# EAGLE design narodmon-sch (EAGLE 8.0.1)
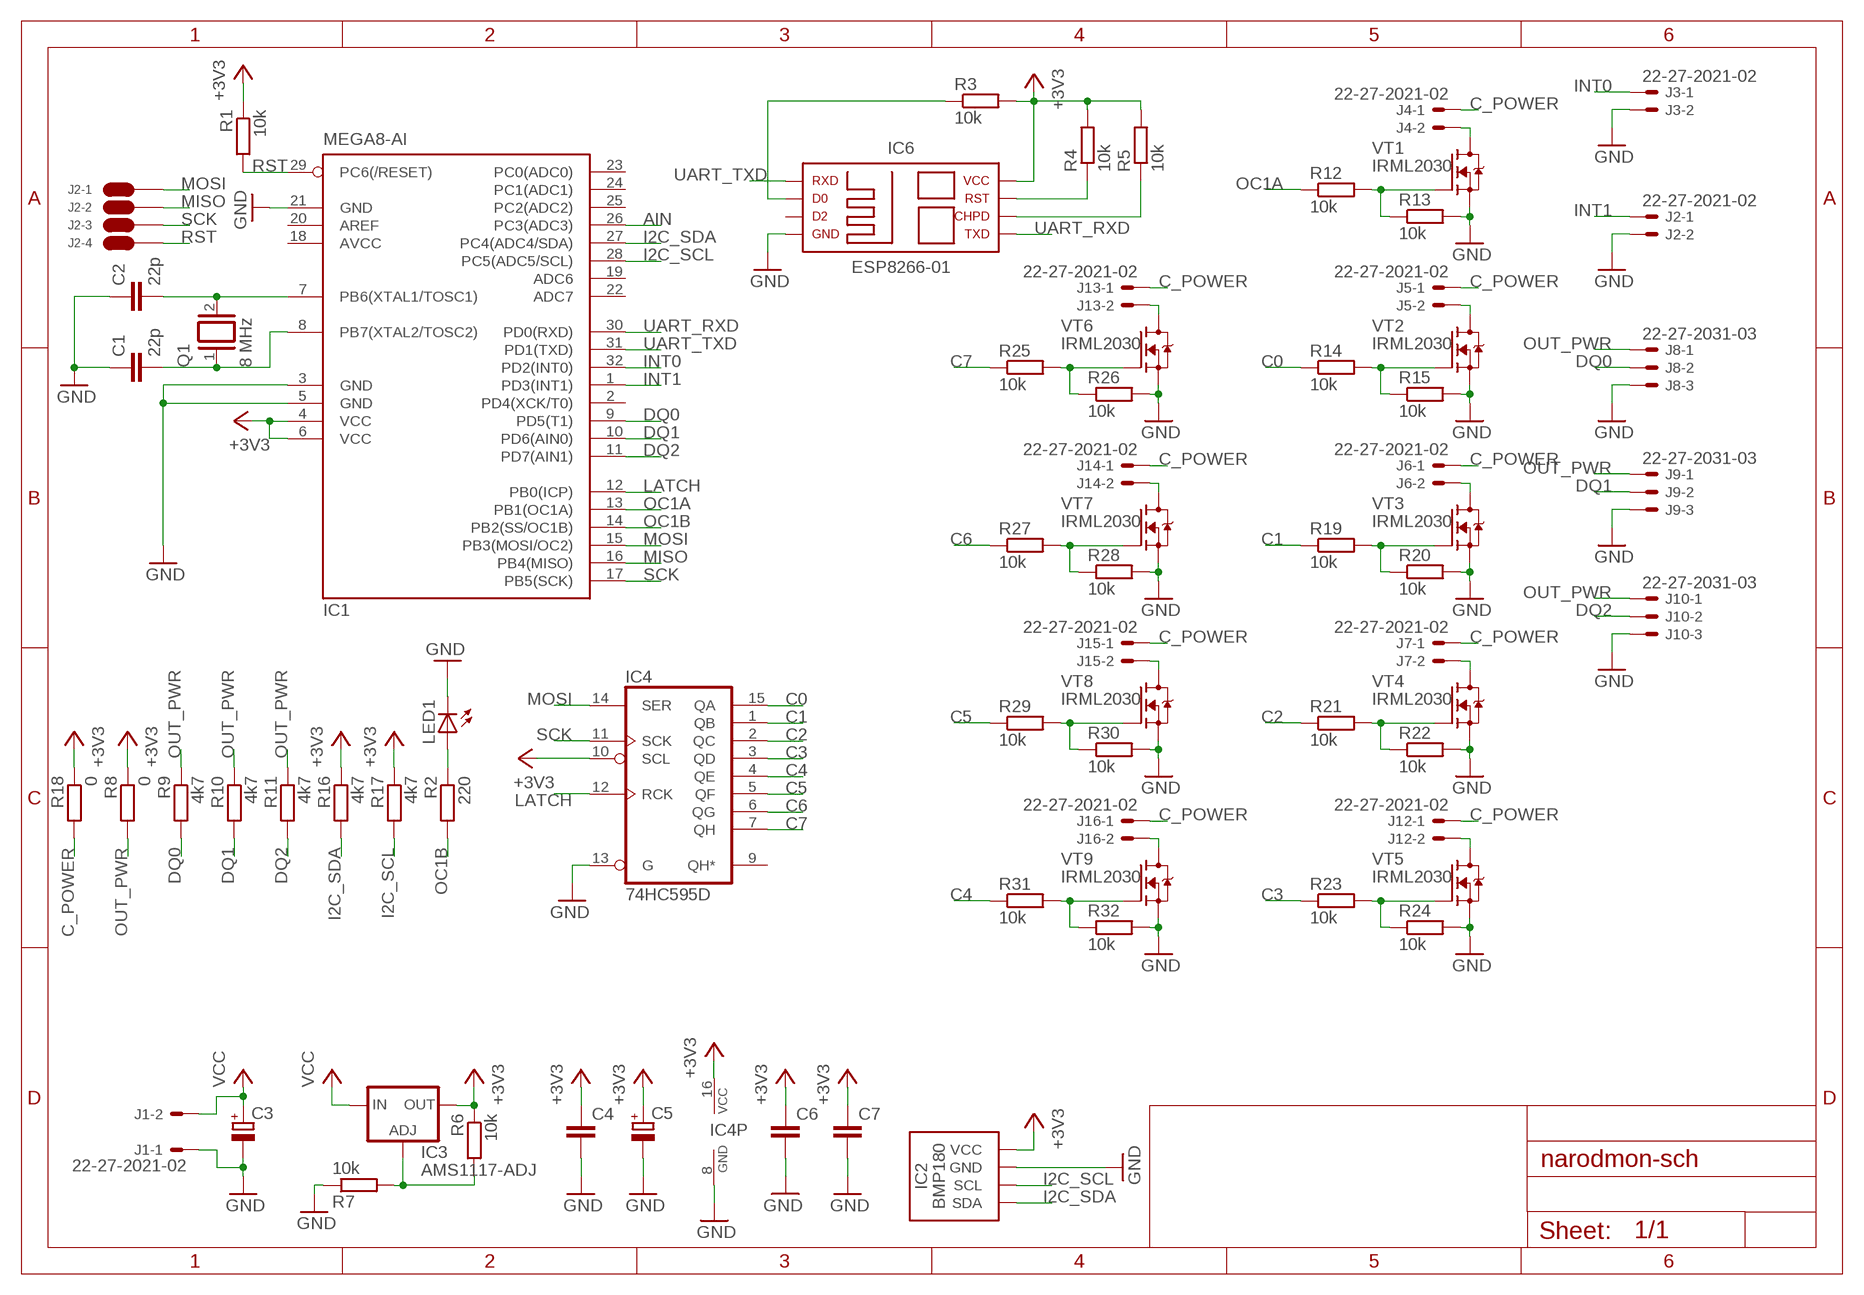
[diagram p0: schematic, sheet 1]

## Parts
C1  22p  C-EUC0603  [C0603]
C2  22p  C-EUC0603  [C0603]
C3  CPOL-EUE3.5-10  [E3,5-10]
C4  C-EUC0805  [C0805]
C5  CPOL-EUE2.5-7  [E2,5-7]
C6  C-EUC0805  [C0805]
C7  C-EUC0805  [C0805]
IC1  MEGA8-AI  [TQFP32-08]
IC2  BMP180C  [BMP180-CHIP]
IC3  AMS1117-ADJ  [SOT223]
IC4  74HC595D  [SO16]
IC6  ESP-01  [ESP-01]
J1  22-27-2021-02  [6410-02]
J2  22-27-2021-02  [6410-02]
J2-1  W1  [W1]
J2-2  W1  [W1]
J2-3  W1  [W1]
J2-4  W1  [W1]
J3  22-27-2021-02  [6410-02]
J4  22-27-2021-02  [6410-02]
J5  22-27-2021-02  [6410-02]
J6  22-27-2021-02  [6410-02]
J7  22-27-2021-02  [6410-02]
J8  22-27-2031-03  [6410-03]
J9  22-27-2031-03  [6410-03]
J10  22-27-2031-03  [6410-03]
J12  22-27-2021-02  [6410-02]
J13  22-27-2021-02  [6410-02]
J14  22-27-2021-02  [6410-02]
J15  22-27-2021-02  [6410-02]
J16  22-27-2021-02  [6410-02]
LED1  LED3MM  [LED3MM]
Q1  8 MHz  XTAL/S  [QS]
R1  10k  R-EU_R0603  [R0603]
R2  220  R-EU_R0603  [R0603]
R3  10k  R-EU_R0603  [R0603]
R4  10k  R-EU_R0603  [R0603]
R5  10k  R-EU_R0603  [R0603]
R6  10k  R-EU_R0603  [R0603]
R7  10k  R-EU_R0603  [R0603]
R8  0  R-EU_R1206  [R1206]
R9  4k7  R-EU_R0603  [R0603]
R10  4k7  R-EU_R0603  [R0603]
R11  4k7  R-EU_R0603  [R0603]
R12  10k  R-EU_R0603  [R0603]
R13  10k  R-EU_R0603  [R0603]
R14  10k  R-EU_R0603  [R0603]
R15  10k  R-EU_R0603  [R0603]
R16  4k7  R-EU_R0603  [R0603]
R17  4k7  R-EU_R0603  [R0603]
R18  0  R-EU_0204/7  [0204/7]
R19  10k  R-EU_R0603  [R0603]
R20  10k  R-EU_R0603  [R0603]
R21  10k  R-EU_R0603  [R0603]
R22  10k  R-EU_R0603  [R0603]
R23  10k  R-EU_R0603  [R0603]
R24  10k  R-EU_R0603  [R0603]
R25  10k  R-EU_R0603  [R0603]
R26  10k  R-EU_R0603  [R0603]
R27  10k  R-EU_R0603  [R0603]
R28  10k  R-EU_R0603  [R0603]
R29  10k  R-EU_R0603  [R0603]
R30  10k  R-EU_R0603  [R0603]
R31  10k  R-EU_R0603  [R0603]
R32  10k  R-EU_R0603  [R0603]
VT1  IRML2030  [SOT23]
VT2  IRML2030  [SOT23]
VT3  IRML2030  [SOT23]
VT4  IRML2030  [SOT23]
VT5  IRML2030  [SOT23]
VT6  IRML2030  [SOT23]
VT7  IRML2030  [SOT23]
VT8  IRML2030  [SOT23]
VT9  IRML2030  [SOT23]

## Nets
+3V3: C4.1 C5.+ C6.1 C7.1 IC1.4(VCC) IC1.6(VCC) IC2.P$2(VCC) IC2.P$3(VCC) IC3.2(OUT) IC3.4(OUT) IC4.10(SCL) IC4.16(VCC) IC6.VCC R1.1 R3.2 R4.2 R5.2 R6.1 R8.1 R16.1 R17.1 R18.1
AIN: IC1.26(PC3(ADC3))
C0: IC4.15(QA) R14.1
C1: IC4.1(QB) R19.1
C2: IC4.2(QC) R21.1
C3: IC4.3(QD) R23.1
C4: IC4.4(QE) R31.1
C5: IC4.5(QF) R29.1
C6: IC4.6(QG) R27.1
C7: IC4.7(QH) R25.1
C_POWER: J4.1 J5.1 J6.1 J7.1 J12.1 J13.1 J14.1 J15.1 J16.1 R18.2
DQ0: IC1.9(PD5(T1)) J8.2 R9.2
DQ1: IC1.10(PD6(AIN0)) J9.2 R10.2
DQ2: IC1.11(PD7(AIN1)) J10.2 R11.2
ESP_CHPD: IC6.CH_PD R5.1
ESP_G0: IC6.GPIO0 R3.1
ESP_RST: IC6.RST R4.1
GND: C1.1 C2.1 C3.- C4.2 C5.- C6.2 C7.2 IC1.3(GND) IC1.5(GND) IC1.21(GND) IC2.P$7(GND) IC4.8(GND) IC4.13(G) IC6.GND J1.1 J2.2 J3.2 J8.3 J9.3 J10.3 LED1.K(C) R7.1 R13.2 R15.2 R20.2 R22.2 R24.2 R26.2 R28.2 R30.2 R32.2 VT1.2(S) VT2.2(S) VT3.2(S) VT4.2(S) VT5.2(S) VT6.2(S) VT7.2(S) VT8.2(S) VT9.2(S)
I2C_SCL: IC1.28(PC5(ADC5/SCL)) IC2.P$5(SCL) R17.2
I2C_SDA: IC1.27(PC4(ADC4/SDA)) IC2.P$6(SDA) R16.2
INT0: IC1.32(PD2(INT0)) J3.1
INT1: IC1.1(PD3(INT1)) J2.1
LATCH: IC1.12(PB0(ICP)) IC4.12(RCK)
MISO: IC1.16(PB4(MISO)) J2-2.P$1
MOSI: IC1.15(PB3(MOSI/OC2)) IC4.14(SER) J2-1.P$1
N$1: J4.2 VT1.3(D)
N$2: C2.2 IC1.7(PB6(XTAL1/TOSC1)) Q1.2
N$3: C1.2 IC1.8(PB7(XTAL2/TOSC2)) Q1.1
N$4: R12.2 R13.1 VT1.1(G)
N$5: R14.2 R15.1 VT2.1(G)
N$6: LED1.A R2.1
N$7: J5.2 VT2.3(D)
N$8: R19.2 R20.1 VT3.1(G)
N$9: J6.2 VT3.3(D)
N$10: R21.2 R22.1 VT4.1(G)
N$11: J7.2 VT4.3(D)
N$12: R23.2 R24.1 VT5.1(G)
N$13: J12.2 VT5.3(D)
N$14: R25.2 R26.1 VT6.1(G)
N$15: J13.2 VT6.3(D)
N$16: R27.2 R28.1 VT7.1(G)
N$17: J14.2 VT7.3(D)
N$18: R29.2 R30.1 VT8.1(G)
N$19: J15.2 VT8.3(D)
N$20: R31.2 R32.1 VT9.1(G)
N$21: J16.2 VT9.3(D)
N$29: IC3.1(ADJ) R6.2 R7.2
OC1A: IC1.13(PB1(OC1A)) R12.1
OC1B: IC1.14(PB2(SS/OC1B)) R2.2
OUT_PWR: J8.1 J9.1 J10.1 R8.2 R9.1 R10.1 R11.1
RST: IC1.29(PC6(/RESET)) J2-4.P$1 R1.2
SCK: IC1.17(PB5(SCK)) IC4.11(SCK) J2-3.P$1
UART_RXD: IC1.30(PD0(RXD)) IC6.TXD
UART_TXD: IC1.31(PD1(TXD)) IC6.RXC(RXD)
VCC: C3.+ IC3.3(IN) J1.2
Unconnected: IC1.2(PD4(XCK/T0)) IC1.19(ADC6) IC1.20(AREF) IC1.22(ADC7) IC1.23(PC0(ADC0)) IC1.24(PC1(ADC1)) IC1.25(PC2(ADC2)) IC4.9(QH*) IC6.GPIO2

## Power pins joined to a net without a drawn wire
AVCC: IC1.18(AVCC)

## Library data of the parts
C1 C2 C4 C6 C7 = rcl:C-EU: CAPACITOR, European symbol
C3 C5 = rcl:CPOL-EU: POLARIZED CAPACITOR, European symbol
IC1 = atmel:MEGA8: MICROCONTROLLER 8 Kbytes FLASH, 1 kbytes SRAM, 512 bytes EEPROM, USART, 6-channel 10 bit ADC, 2-channel 8 bit ADC Pin compatible with Atmega48, ATMega88, ATMega168 Source: avr.lbr; MPN: ATMEGA8-16AU; OC_FARNELL: 9171371; OC_NEWARK: 73M8863
IC2 = narodmon:BMP180
IC3 = narodmon:AMS1117-ADJ
IC4 = 74xx-eu:74*595: 8-bit SHIFT REGISTER, output latch
IC6 = narodmon:ESP-01
J1-J7 J12-J16 = con-molex:22-?-02: CONNECTOR wire to board 2.54 mm (.1 inch) pitch header; OC_FARNELL: unknown; OC_NEWARK: unknown
J2-1-J2-4 = Thermo:W
J8-J10 = con-molex:22-?-03: CONNECTOR wire to board 2.54 mm (.1 inch) pitch header; OC_FARNELL: unknown; OC_NEWARK: unknown
LED1 = led:LED: LED OSRAM: - CHIPLED LG R971, LG N971, LY N971, LG Q971, LY Q971, LO R971, LY R971 LH N974, LH R974 LS Q976, LO Q976, LY Q976 LO Q996 - Hyper CHIPLED LW Q18S LB Q993, LB Q99A, LB R99A - SideLED LS A670, LO A670, LY A670, LG A670, LP A670 LB A673, LV A673, LT A673, LW A673 LH A674 LY A675 LS A676, LA A676, LO A676, LY A676, LW A676 LS A679, LY A679, LG A679 - Hyper Micro SIDELED® LS Y876, LA Y876, LO Y876, LY Y876 LT Y87S - SmartLED LW L88C, LW L88S LB L89C, LB L89S, LG L890 LS L89K, LO L89K, LY L89K LS L896, LA L896, LO L896, LY L896 - TOPLED LS T670, LO T670, LY T670, LG T670, LP T670 LSG T670, LSP T670, LSY T670, LOP T670, LYG T670 LG T671, LOG T671, LSG T671 LB T673, LV T673, LT T673, LW T673 LH T674 LS T676, LA T676, LO T676, LY T676, LB T676, LH T676, LSB T676, LW T676 LB T67C, LV T67C, LT T67C, LS T67K, LO T67K, LY T67K, LW E67C LS E67B, LA E67B, LO E67B, LY E67B, LB E67C, LV E67C, LT E67C LW T67C LS T679, LY T679, LG T679 LS T770, LO T770, LY T770, LG T770, LP T770 LB T773, LV T773, LT T773, LW T773 LH T774 LS E675, LA E675, LY E675, LS T675 LS T776, LA T776, LO T776, LY T776, LB T776 LHGB T686 LT T68C, LB T68C - Hyper Mini TOPLED® LB M676 - Mini TOPLED Santana® LG M470 LS M47K, LO M47K, LY M47K Source: http://www.osram.convergy.de LUXEON: - LUMILED® LXK2-PW12-R00, LXK2-PW12-S00, LXK2-PW14-U00, LXK2-PW14-V00 LXK2-PM12-R00, LXK2-PM12-S00, LXK2-PM14-U00 LXK2-PE12-Q00, LXK2-PE12-R00, LXK2-PE12-S00, LXK2-PE14-T00, LXK2-PE14-U00 LXK2-PB12-K00, LXK2-PB12-L00, LXK2-PB12-M00, LXK2-PB14-N00, LXK2-PB14-P00, LXK2-PB14-Q00 LXK2-PR12-L00, LXK2-PR12-M00, LXK2-PR14-Q00, LXK2-PR14-R00 LXK2-PD12-Q00, LXK2-PD12-R00, LXK2-PD12-S00 LXK2-PH12-R00, LXK2-PH12-S00 LXK2-PL12-P00, LXK2-PL12-Q00, LXK2-PL12-R00 Source: www.luxeon.com KINGBRIGHT: KA-3528ASYC Source: www.kingbright.com
Q1 = special:XTAL/S: CRYSTAL
R1-R32 = rcl:R-EU_: RESISTOR, European symbol
VT1-VT9 = narodmon:IRML2030

## Board
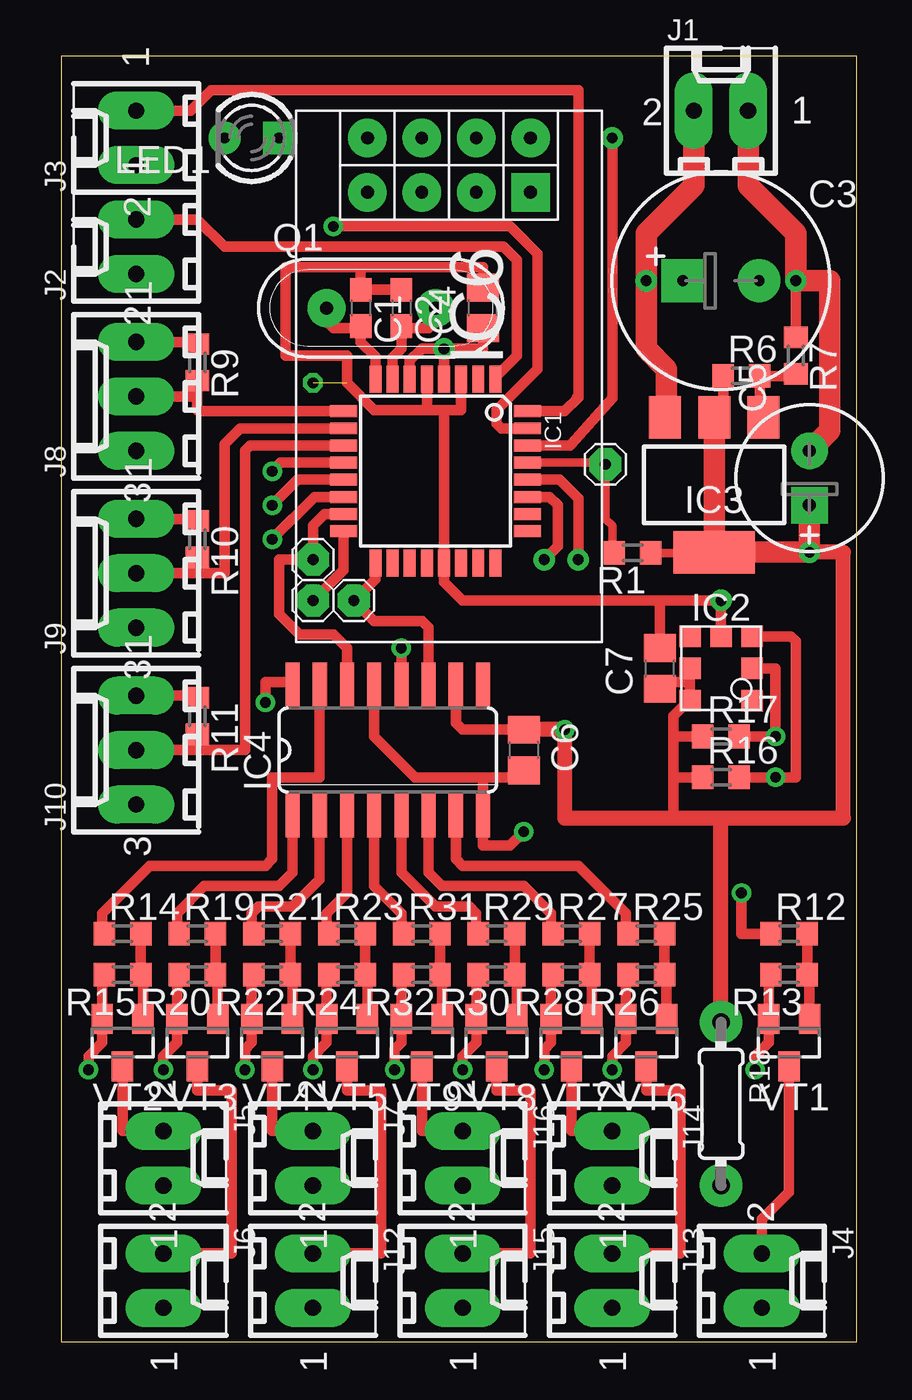
[diagram p1: board, top side]
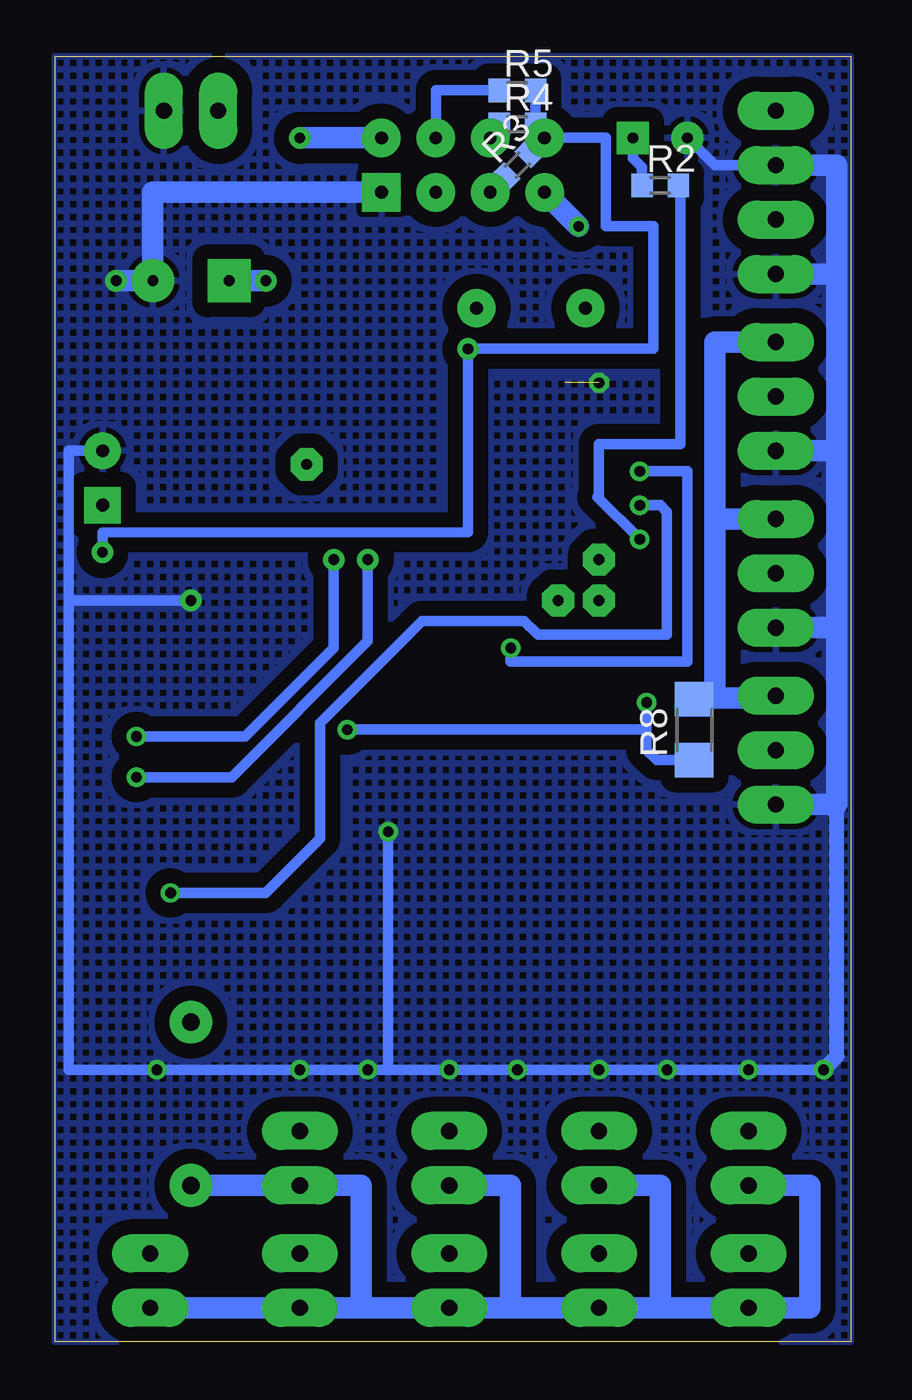
[diagram p2: board, bottom side, seen from below]

Size 37.14 x 60 mm. Coordinates in mm from the lower left corner, seen from the top.
Outline: 0,0 37.14,0 37.14,60 0,60 0,0
Copper layers (1*16): Top 0.035mm / dielectric 1.5mm / Bottom 0.035mm
Design rules "default *": minimum track width 10mil, minimum drill 24mil, track to track 8mil, track to pad 8mil, pad to pad 8mil, via to via 8mil, smd to smd 8mil, copper to edge 0mil, drill to drill 8mil, minimum pad ring 10mil, minimum via ring 8mil, stop-mask expansion 4mil, vias tented up to drill 0mil, thermal gap 10mil

### Footprints (pad centres in the part's own frame; a part is rotated, then mirrored left to right if it is on the bottom)
C0603 = smd 1.1 x 1: 1 -0.85,0; 2 0.85,0
E3,5-10 = drill 0.5 pad 2 square: + -1.778,0 | drill 0.5 pad 2: - 1.778,0
C0805 = smd 1.3 x 1.5: 1 -0.95,0; 2 0.95,0
E2,5-7 = drill 0.6 pad 1.7 square: + -1.27,0 | drill 0.6 pad 1.7: - 1.27,0
TQFP32-08 = smd 1.27 x 0.559: 1 -4.293,2.8; 2 -4.293,2; 3 -4.293,1.2; 4 -4.293,0.4; 5 -4.293,-0.4; 6 -4.293,-1.2; 7 -4.293,-2; 8 -4.293,-2.8; 17 4.293,-2.8; 18 4.293,-2; 19 4.293,-1.2; 20 4.293,-0.4; 21 4.293,0.4; 22 4.293,1.2; 23 4.293,2; 24 4.293,2.8 | smd 0.559 x 1.27: 9 -2.8,-4.293; 10 -2,-4.293; 11 -1.2,-4.293; 12 -0.4,-4.293; 13 0.4,-4.293; 14 1.2,-4.293; 15 2,-4.293; 16 2.8,-4.293; 25 2.8,4.293; 26 2,4.293; 27 1.2,4.293; 28 0.4,4.293; 29 -0.4,4.293; 30 -1.2,4.293; 31 -2,4.293; 32 -2.8,4.293
BMP180-CHIP = smd 1 x 1: P$1 -1.45,1.5; P$2 -1.45,0; P$3 -1.45,-1.5; P$4 1.45,-1.5; P$5 1.45,0; P$6 1.45,1.5; P$7 0,1.5
SOT223 = smd 1.5 x 2: 1 -2.3,-3.15; 2 0,-3.15; 3 2.3,-3.15 | smd 3.8 x 2: 4 0,3.15
SO16 = smd 0.66 x 2.032: 1 -4.445,-3.073; 2 -3.175,-3.073; 3 -1.905,-3.073; 4 -0.635,-3.073; 5 0.635,-3.073; 6 1.905,-3.073; 7 3.175,-3.073; 8 4.445,-3.073; 9 4.445,3.073; 10 3.175,3.073; 11 1.905,3.073; 12 0.635,3.073; 13 -0.635,3.073; 14 -1.905,3.073; 15 -3.175,3.073; 16 -4.445,3.073
ESP-01 = drill 0.6 pad 1.8: CH_PD -1.27,-1.27; GPIO0 -3.81,1.27; GPIO2 -3.81,-1.27; RST -1.27,1.27; RXC -3.81,3.81; TXD -1.27,-3.81; VCC -1.27,3.81 | drill 0.6 pad 1.8 square: GND -3.81,-3.81
6410-02 = drill 0.762 pad 1.778 long: 1 1.27,0; 2 -1.27,0
W1 = drill 0.5 pad 1.5 octagon: P$1 0,0
6410-03 = drill 0.762 pad 1.778 long: 1 2.54,0; 2 0,0; 3 -2.54,0
LED3MM = drill 0.5 pad 1.5 square: A -1.27,0 | drill 0.5 pad 1.5: K 1.27,0
QS = drill 0.61 pad 1.778: 1 -2.54,0; 2 2.54,0
R0603 = smd 1 x 1.1: 1 -0.85,0; 2 0.85,0
R1206 = smd 1.6 x 1.803: 1 -1.422,0; 2 1.422,0
0204/7 = drill 0.813 pad 2: 1 -3.81,0; 2 3.81,0
SOT23 = smd 1 x 1.4: 1 -0.95,-1.1; 2 0.95,-1.1; 3 0,1.1

### Placement (x,y rotation side)
C1  13.97,48.26 270 top
C2  15.88,48.26 270 top
C3  30.8,49.53 0 top
C4  19.68,48.26 90 top
C5  34.92,40.32 90 top
C6  21.59,27.62 270 top
C7  27.94,31.43 90 top
IC1  17.46,40.64 270 top
IC2  30.8,31.43 0 top
IC3  30.48,40.01 180 top
IC4  15.24,27.62 0 top
IC6  18.1,57.47 90 top
J1  30.8,57.47 0 top
J2  3.49,51.12 90 top
J2-1  11.75,36.51 0 top
J2-2  11.75,34.61 0 top
J2-3  13.65,34.61 0 top
J2-4  25.4,40.96 0 top
J3  3.49,56.2 90 top
J4  32.7,2.86 270 top
J5  4.76,8.57 270 top
J6  4.76,2.86 270 top
J7  11.75,8.57 270 top
J8  3.49,44.13 90 top
J9  3.49,35.88 90 top
J10  3.49,27.62 90 top
J12  11.75,2.86 270 top
J13  25.72,2.86 270 top
J14  25.72,8.57 270 top
J15  18.73,2.86 270 top
J16  18.73,8.57 270 top
LED1  8.89,56.2 180 top
Q1  14.92,48.26 0 top
R1  26.67,36.83 180 top
R2  8.89,53.98 0 bottom
R3  15.56,54.93 45 bottom
R4  15.56,56.83 0 bottom
R5  15.56,58.42 0 bottom
R6  31.75,45.09 0 top
R7  34.29,46.04 270 top
R8  7.3,28.57 90 bottom
R9  6.35,45.72 270 top
R10  6.35,37.47 270 top
R11  6.35,29.21 270 top
R12  33.97,19.05 0 top
R13  33.97,17.14 180 top
R14  2.86,19.05 0 top
R15  2.86,17.14 180 top
R16  30.8,26.35 0 top
R17  30.8,28.26 0 top
R18  30.8,11.11 270 top
R19  6.35,19.05 0 top
R20  6.35,17.14 180 top
R21  9.84,19.05 0 top
R22  9.84,17.14 180 top
R23  13.34,19.05 0 top
R24  13.34,17.14 180 top
R25  27.3,19.05 0 top
R26  27.3,17.14 180 top
R27  23.81,19.05 0 top
R28  23.81,17.14 180 top
R29  20.32,19.05 0 top
R30  20.32,17.14 180 top
R31  16.83,19.05 0 top
R32  16.83,17.14 180 top
VT1  33.97,13.97 180 top
VT2  2.86,13.97 180 top
VT3  6.35,13.97 180 top
VT4  9.84,13.97 180 top
VT5  13.34,13.97 180 top
VT6  27.3,13.97 180 top
VT7  23.81,13.97 180 top
VT8  20.32,13.97 180 top
VT9  16.83,13.97 180 top

### Tracks (layer width: path | path; a pad name or v marks a point on that pad's centre or on a via)
+3V3  (via drill 0.5, 0.5 pad 1)  (1 unrouted)
  Top 0.406: R1.1 30.45,36.83 IC3.4
  Top 0.5: C6.1 18.73,28.57 18.41,28.89 IC4.10 | IC4.16 10.69,30.8 9.53,30.8 v9.53,29.84 | IC1.6 16.26,45.79 16.83,46.35 v17.86,46.35 | IC1.4 v17.86,46.35 | v17.86,46.35 19.68,46.35 C4.1 | IC2.P$2 29.35,30.8 | 29.35,30.8 IC2.P$3 29.3,29.93 28.57,29.21 28.57,28.26 | 28.57,26.35 28.57,28.26 | 28.57,26.35 R16.1 | R17.1 28.57,28.26 | 29.35,30.8 28.25,30.8 C7.1 | 28.57,24.45 28.57,26.35 | R6.1 30.9,43.58 IC3.2
  Top 0.7: v23.5,28.57 C6.1 | R18.1 30.8,24.45 | v23.5,28.57 23.5,24.45 28.57,24.45 30.8,24.45 | 30.8,24.45 36.51,24.45 36.51,36.85 v34.92,36.85
  Top 1: IC3.2 IC3.4 v34.92,36.85 C5.+
  Bottom 0.5: 9.53,28.57 v9.53,29.84 | 9.53,28.57 v23.5,28.57 | R3.2 IC6.VCC | IC6.VCC 14.29,56.73 | R5.2 R4.2 14.29,56.41 IC6.VCC | R8.1 9.06,27.15 9.53,27.62 9.53,28.57 | v34.92,36.85 34.92,37.78 17.86,37.81 v17.86,46.35 9.21,46.35 9.21,52.07 11.43,52.07 11.43,56.2 IC6.VCC
C0
  Top 0.5: IC4.15 12.06,26.35 9.84,26.35 9.84,22.54 9.53,22.23 4.13,22.23 1.91,20 1.91,19.15 R14.1
C1
  Top 0.5: IC4.1 10.79,21.91 10.16,21.27 6.67,21.27 5.4,20 5.4,19.15 R19.1
C2
  Top 0.5: IC4.2 12.06,21.59 10.79,20.32 9.21,20.32 8.89,20 8.89,19.15 R21.1
C3
  Top 0.5: IC4.3 13.34,20.95 12.38,20 12.38,19.15 R23.1
C4
  Top 0.5: IC4.4 14.61,21.27 15.88,20 15.88,19.15 R31.1
C5
  Top 0.5: IC4.5 15.88,21.91 17.46,20.32 19.05,20.32 19.37,20 19.37,19.15 R29.1
C6
  Top 0.5: IC4.6 17.14,21.91 17.78,21.27 21.59,21.27 22.86,20 22.86,19.15 R27.1
C7
  Top 0.5: IC4.7 18.41,22.54 18.73,22.23 24.13,22.23 26.35,20 26.35,19.15 R25.1
C_POWER
  Bottom 1: J5.1 1.91,7.3 1.91,1.59 J6.1 J12.1 | J7.1 8.89,7.3 8.89,1.59 J12.1 | J16.1 15.88,7.3 15.88,1.59 J15.1 | J13.1 22.86,1.59 22.86,7.3 J14.1 R18.2 | J12.1 J15.1 | J15.1 J13.1 | J13.1 J4.1
DQ0
  Top 0.5: 6.35,44.13 6.35,43.5 6.41,43.44 IC1.9 | 6.35,44.13 J8.2 | R9.2 6.35,44.13
DQ1
  Top 0.5: IC1.10 8.35,42.64 7.62,41.91 7.62,35.88 6.35,35.88 | 6.35,35.88 J9.2 | R10.2 6.35,35.88
DQ2
  Top 0.5: IC1.11 8.82,41.84 8.57,41.59 8.57,27.62 6.35,27.62 | 6.35,27.62 J10.2 | R11.2 6.35,27.62
ESP_CHPD
  Bottom 0.5: IC6.CH_PD 19.37,58.42 R5.1
ESP_G0
  Bottom 0.5: IC6.GPIO0 R3.1
ESP_RST
  Bottom 0.5: IC6.RST 16.83,56.41 R4.1
GND  (via drill 0.5, 0.5 pad 1)  (1 unrouted)
  Top 0.5: R15.2 1.91,17.14 VT2.2 1.91,13.97 1.27,13.34 v1.27,12.7 | R20.2 5.4,17.14 VT3.2 5.4,13.97 4.76,13.34 v4.76,12.7 | R22.2 8.89,17.14 VT4.2 8.89,13.97 8.57,13.65 v8.57,12.7 | R24.2 12.38,17.14 VT5.2 12.38,13.97 11.75,13.34 v11.75,12.7 | R32.2 15.88,17.14 VT9.2 15.88,13.97 15.56,13.65 v15.56,12.7 | R30.2 19.37,17.14 VT8.2 19.37,13.97 18.73,13.34 v18.73,12.7 | R28.2 22.86,17.14 VT7.2 22.86,13.97 22.54,13.65 v22.54,12.7 | R26.2 26.36,17.14 VT6.2 26.36,13.97 25.72,13.34 v25.72,12.7 | v21.59,23.81 20.95,23.18 19.68,23.18 IC4.8 19.68,26.35 | IC4.13 14.61,28.26 16.51,26.35 19.68,26.35 | R13.2 33.02,17.05 VT1.2 33.02,13.97 32.38,13.34 v32.38,12.7 | C2.1 C1.1 13.97,50.16 | IC1.3 18.66,43.5 17.78,43.5 | 17.06,43.5 IC1.5 | 17.78,43.5 17.06,43.5 | 13.97,50.16 10.48,50.16 10.48,46.04 13.34,46.04 13.34,44.77 14.61,43.5 17.06,43.5 | 13.97,50.16 19.68,50.16 C4.2 | IC2.P$7 v30.8,34.61 27.94,34.61 | 27.94,34.61 C7.2 | 17.78,43.5 17.86,43.41 IC1.21 17.86,35.48 18.73,34.61 27.94,34.61 | v34.29,49.53 R7.1 | 19.68,26.35 21.27,26.35 C6.2
  Top 1: J1.1 32.07,53.98 34.29,51.75 v34.29,49.53 35.88,49.53 35.88,42.55 C5.-
  Bottom 0.5: v1.27,12.7 v4.76,12.7 v8.57,12.7 v11.75,12.7 v15.56,12.7 v18.73,12.7 21.59,12.7 | 21.59,12.7 v22.54,12.7 v25.72,12.7 v32.38,12.7 36.51,12.7 36.51,34.61 | v21.59,23.81 21.59,12.7 | J3.2 6.35,54.93 LED1.K | C5.- 36.51,41.59 36.51,34.61 | 36.51,34.61 v30.8,34.61
  Bottom 0.7: v1.27,12.7 0.64,13.34 0.64,25.08
  Bottom 1: 0.64,41.59 0.64,33.34 | 0.64,33.34 0.64,25.08 J10.3 | J9.3 0.64,33.34 | J8.3 0.64,41.59 | J2.2 0.64,49.85 | 0.64,49.85 0.64,54.93 J3.2 | 0.64,49.85 0.64,41.59 | v34.29,49.53 C3.- 32.58,53.66 IC6.GND
  other vias: 11.75,44.77
  pour Bottom (isolate 0.7, hatched): 0,60.01 37.15,60.01 37.15,0 0,0
I2C_SCL  (via drill 0.5, 0.5 pad 1)
  Top 0.5: R17.2 v33.34,28.26 33.34,31.43 IC2.P$5 | IC1.28 23.26,40.24 24.13,39.37 v24.13,36.51
  Bottom 0.5: v33.34,28.26 28.26,28.26 24.13,32.38 v24.13,36.51
I2C_SDA  (via drill 0.5, 0.5 pad 1)
  Top 0.5: IC2.P$6 34.06,32.93 34.29,32.7 34.29,26.35 v33.34,26.35 R16.2 | IC1.27 22.79,39.44 23.18,39.05 23.18,37.15 v22.54,36.51
  Bottom 0.5: v22.54,36.51 22.54,32.7 28.89,26.35 v33.34,26.35
INT0
  Top 0.5: J3.1 6.03,57.47 6.99,58.42 24.13,58.42 24.13,44.08 | 24.13,44.08 24.07,44.08 | IC1.32 23.5,43.44 24.13,44.08
INT1
  Top 0.5: IC1.1 20.26,45.03 21.27,46.04 21.27,50.48 20.64,51.12 7.62,51.12 6.35,52.39 J2.1
LATCH  (via drill 0.5)
  Top 0.5: IC1.12 10.24,41.04 v9.84,40.64 | v15.88,32.38 IC4.12
  Bottom 0.5: v9.84,40.64 7.62,40.64 7.62,31.75 15.88,31.75 v15.88,32.38
MISO
  Top 0.5: IC1.16 13.17,36.03 J2-2.P$1
MOSI
  Top 0.5: IC1.15 12.29,38.64 11.75,38.1 J2-1.P$1 10.16,36.51 10.16,33.97 11.11,33.02 12.7,33.02 13.34,32.38 IC4.14
N$1
  Top 0.5: VT1.3 33.97,6.99 32.7,5.71 J4.2
N$2
  Top 0.5: IC1.7 15.46,45.94 15.88,46.35 C2.2 15.98,47.31 17.14,47.31 17.46,47.62 Q1.2
N$3
  Top 0.5: IC1.8 14.66,45.98 13.97,46.67 C1.2 13.87,47.31 12.7,47.31 12.38,47.62 Q1.1
N$4
  Top 0.5: VT1.1 34.92,17.05 R13.1 R12.2
N$5
  Top 0.5: VT2.1 3.81,17.14 R15.1 R14.2
N$6
  Bottom 0.5: R2.1 9.74,54.83 10.16,55.24 LED1.A
N$7
  Top 0.5: VT2.3 2.86,9.84 J5.2
N$8
  Top 0.5: VT3.1 7.3,17.14 R20.1 R19.2
N$9
  Top 0.5: VT3.3 6.35,11.75 7.94,11.75 7.94,4.13 J6.2
N$10
  Top 0.5: VT4.1 10.79,17.14 R22.1 R21.2
N$11
  Top 0.5: VT4.3 9.84,9.84 J7.2
N$12
  Top 0.5: VT5.1 14.29,17.14 R24.1 R23.2
N$13
  Top 0.5: VT5.3 13.34,11.75 14.92,11.75 14.92,4.13 J12.2
N$14
  Top 0.5: VT6.1 28.25,17.14 R26.1 R25.2
N$15
  Top 0.5: VT6.3 27.3,11.75 28.89,11.75 28.89,4.13 J13.2
N$16
  Top 0.5: VT7.1 24.76,17.14 R28.1 R27.2
N$17
  Top 0.5: VT7.3 23.81,9.84 J14.2
N$18
  Top 0.5: VT8.1 21.27,17.14 R30.1 R29.2
N$19
  Top 0.5: VT8.3 20.32,11.75 21.91,11.75 21.91,4.13 J15.2
N$20
  Top 0.5: VT9.1 17.78,17.14 R32.1 R31.2
N$21
  Top 0.5: VT9.3 16.83,9.84 J16.2
N$29
  Top 0.5: IC3.1 32.6,43.34 R6.2 34.19,45.09 R7.2
OC1A  (via drill 0.5)
  Top 0.5: IC1.13 11.03,40.24 v9.84,39.05 | v31.75,20.95 31.75,19.05 R12.1
  Bottom 0.5: v9.84,39.05 8.89,39.05 8.57,38.73 8.57,33.02 14.61,33.02 15.24,33.66 20,33.66 24.77,28.89 24.77,23.5 27.3,20.95 v31.75,20.95
OC1B  (via drill 0.5)
  Top 0.5: IC1.14 11.82,39.44 v9.84,37.47
  Bottom 0.5: v9.84,37.47 11.82,39.44 11.75,39.51 11.75,41.91 7.94,41.91 7.94,53.66 8.04,53.87 R2.2
OUT_PWR
  Top 0.5: J8.1 6.67,46.67 R9.1 | J9.1 6.35,38.42 R10.1 | J10.1 6.35,30.16 R11.1
  Bottom 0.5: R8.2 6.41,30 R11.1
  Bottom 1: 6.35,38.42 6.35,46.67 J8.1 | 6.35,38.42 R11.1 3.49,30.06 J10.1 | J9.1 6.35,38.42
RST
  Top 0.406: IC1.29 25.4,41.04 J2-4.P$1 25.4,38.42 25.72,38.1 25.72,36.93 R1.2
SCK
  Top 0.5: IC1.17 14.66,35.62 J2-3.P$1 14.61,33.66 16.83,33.66 17.14,33.34 IC4.11
UART_RXD  (via drill 0.5 pad 1)
  Top 0.5: IC1.30 23.74,41.84 23.81,41.91 25.72,44.06 v25.72,56.2
  Bottom 1: IC6.TXD v25.72,56.2
UART_TXD  (via drill 0.5)
  Top 0.5: IC1.31 20.54,42.64 20.32,42.86 20.32,43.5 22.23,45.4 22.23,50.8 20.95,52.07 v12.7,52.07
  Bottom 1: IC6.RXC v12.7,52.07
VCC  (via drill 0.5 pad 1)
  Top 1: J1.2 29.53,53.98 27.3,51.75 v27.3,49.53 27.3,46.35 28.26,45.4 28.26,43.23 IC3.3
  Bottom 1: C3.+ v27.3,49.53